# Altium schematic sheet HF_AMP.SchDoc
size A4; Organization: MAHLE International GmbH; Address1: Pragstr. 26 - 46; Address2: 70376 Stuttgart; Address3: Germany; DocumentNumber: 3; SheetNumber: 3; SheetTotal: 3
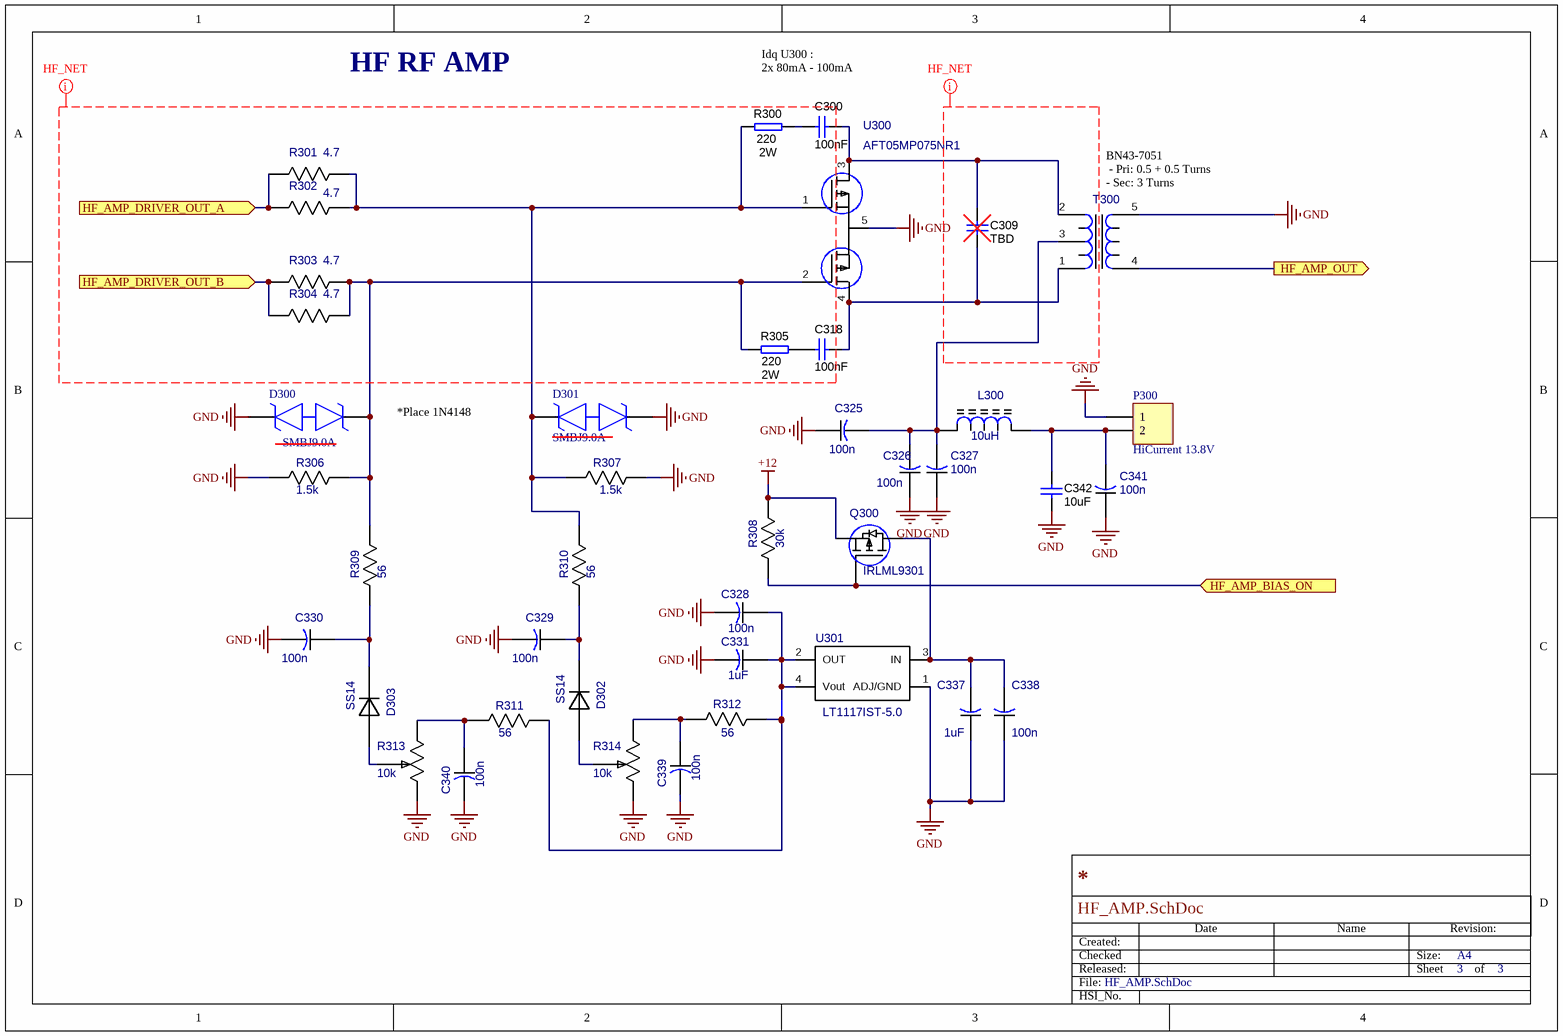
[diagram p0: HF_AMP.SchDoc]

## Parts
C300  value 100nF  [1206_180]
C309  value TBD  [1206_180]
C318  value 100nF  [1206_180]
C325  100n  [CAP_1206]
C326  100n  [CAP_1206]
C327  100n  [CAP_1206]
C328  100n  [CAP_0805]
C329  100n  [CAP_0805]
C330  100n  [CAP_0805]
C331  1uF  [CAP_0805]
C337  1uF  [CAP_0805]
C338  100n  [CAP_0805]
C339  100n  [CAP_0805]
C340  100n  [CAP_0805]
C341  100n  [CAP_0805]
C342  value 10uF  [1206_180]
D300  SMBJ9.0A  [SMBJ36CATR]
D301  SMBJ9.0A  [SMBJ36CATR]
D302  SS14  [SS14]
D303  SS14  [SS14]
L300  10uH  [IND_FERRITE_CORE]
P300  HiCurrent 13.8V  [2 Pole Screw]
Q300  IRLML9301  [SOT23]
R300  value 220  Value2: 2W  [Res_2W]
R301  4.7  [RES_1206]
R302  4.7  [RES_1206]
R303  4.7  [RES_1206]
R304  4.7  [RES_1206]
R305  value 220  Value2: 2W  [Res_2W]
R306  1.5k  [RES_0805]
R307  1.5k  [RES_0805]
R308  30k  [RES_0805]
R309  56  [RES_0805]
R310  56  [RES_0805]
R311  56  [RES_0805]
R312  56  [RES_0805]
R313  value 10k  [3296W-1]  (hidden comment: ADJ-10k)
R314  value 10k  [3296W-1]  (hidden comment: ADJ-10k)
T300  TRANSF_HF2  [TRANSF_HF3 - bn43-7051]  (value not drawn)
U300  AFT05MP075NR1  [AFT05MP075NR1-Direct_Mount]
U301  LT1117IST-5.0  [LT1117IST-ADJ]

## Ports
HF_AMP_BIAS_ON (in), HF_AMP_DRIVER_OUT_A (in), HF_AMP_DRIVER_OUT_B (in), HF_AMP_OUT (out)

## Nets
+12: Q300.2(S) R308.2
GND: C325.1 C326.1 C327.1 C328.2 C329.2 C330.2 C331.2 C337.1 C338.1 C339.2 C340.2 C341.1 C342.1 D300.1 D301.1 P300.1 R306.1 R307.2 R313.1(CCW) R314.1(CCW) T300.5(S2) U300.5(D1) U301.1(ADJ/GND)
HF_AMP_BIAS_ON: Q300.1(G) R308.1 ; port HF_AMP_BIAS_ON
HF_AMP_DRIVER_OUT_A: R301.1 R302.1 ; port HF_AMP_DRIVER_OUT_A
HF_AMP_DRIVER_OUT_B: R303.1 R304.1 ; port HF_AMP_DRIVER_OUT_B
HF_AMP_OUT: T300.4(S1) ; port HF_AMP_OUT
NetC300_1: C300.1 R300.2
NetC300_2: C300.2 C309.2 T300.2(P2) U300.3(D1)
NetC309_1: C309.1 C318.1 T300.1(P1) U300.4(D2)
NetC318_2: C318.2 R305.1
NetC325_2: C325.2 C326.2 C327.2 L300.1(A) T300.3(P3)
NetC328_1: C328.1 C331.1 R311.2 R312.2 U301.2(OUT) U301.4(Vout)
NetC329_1: C329.1 D302.1(K) R310.1
NetC330_1: C330.1 D303.1(K) R309.1
NetC337_2: C337.2 C338.2 Q300.3(D) U301.3(IN)
NetC339_1: C339.1 R312.1 R314.3(CW)
NetC340_1: C340.1 R311.1 R313.3(CW)
NetC341_2: C341.2 C342.2 L300.2(B) P300.2
NetD300_2: D300.2 R303.2 R304.2 R305.2 R306.2 R309.2 U300.2(G2)
NetD301_2: D301.2 R300.1 R301.2 R302.2 R307.1 R310.2 U300.1(G1)
NetD302_2: D302.2(A) R314.2(W)
NetD303_2: D303.2(A) R313.2(W)

## Layout directives
net class HF_NET: (no net found under the mark)

## Notes on the sheet
- HF RF AMP
- Idq U300 :
  2x 80mA - 100mA
- (near T300) BN43-7051
  - Pri: 0.5 + 0.5 Turns
  - Sec: 3 Turns
- *Place 1N4148
- File:
- Created:
- Checked
- Released:
- Date
- Name
- Size:
- Sheet
- Revision:
- A4
- of
- HSI_No.

## Library data of the parts
C300 C309 C318 C342 = C1206: CAP, CERM, +/- 10%, X7R, 1206; Tolerance_%: 10; TaMin_C: -55; TaMax_C: 125; SizeArea_mm2: 5.12; SizeAreaWB_mm2: 10.92; SizeX_mm: 3.2; SizeY_mm: 1.6; SizeZ_mm: 1.8; Value1: 100V; PackageReference: 1206; MountType: SMT; Technology: Ceramic; TempCo: X7R
C325-C327 C341 = CAP_1206
C328-C331 C337-C340 = CAP_0805
  C328-C330 C338-C340: Value: 100n
  C331 C337: Value: 1uF
D300 D301 = SMBJ16CA: TVS Diode (Bi-directional); Manufacturer_Name: Bourns; Datasheet Link: https://componentsearchengine.com/Datasheets/2/SMBJ16CA.pdf; Height: 2.61mm; Manufacturer_Part_Number: SMBJ16CA; Mouser Part Number: 652-SMBJ16CA; Mouser Price/Stock: https://www.mouser.co.uk/ProductDetail/Bourns/SMBJ16CA?qs=d7fLapxX37HIDtp0KgHIow%3D%3D; Arrow Part Number: SMBJ16CA; Arrow Price/Stock: https://www.arrow.com/en/products/smbj16ca/bourns
L300 = IND_FERRITE_CORE: Inductor; Value: 10uH
P300 = Header 2: Header, 2-Pin; LatestRevisionDate: 17-Jul-2002; LatestRevisionNote: Re-released for DXP Platform.; Publisher: Altium Limited
Q300 = MOSFET_ENH_PD: MOSFET; Value: IRLML9301
R300 R305 = R1206: RES; CompType: Resistor; Tolerance_%: 1; Value1: 1%; TempCo: 100 ppm/C; SizeArea_mm2: 5.12; SizeX_mm: 3.2; SizeY_mm: 1.6; SizeZ_mm: 1.35; PackageReference: 1206; MountType: SMT; Technology: Thick Film
R301-R304 = RES_1206
R306-R312 = RES_0805
  R308: Value: 30k
R313 R314 = 306J: 3296W-1-103LF
T300 = TRANSF_RF2: Value: *
U301 = LT1117IST-ADJ
D302 D303 = SS14: Value: SS14